# EAGLE design Occupancy PCB Final Rev B (EAGLE 7.5.0)
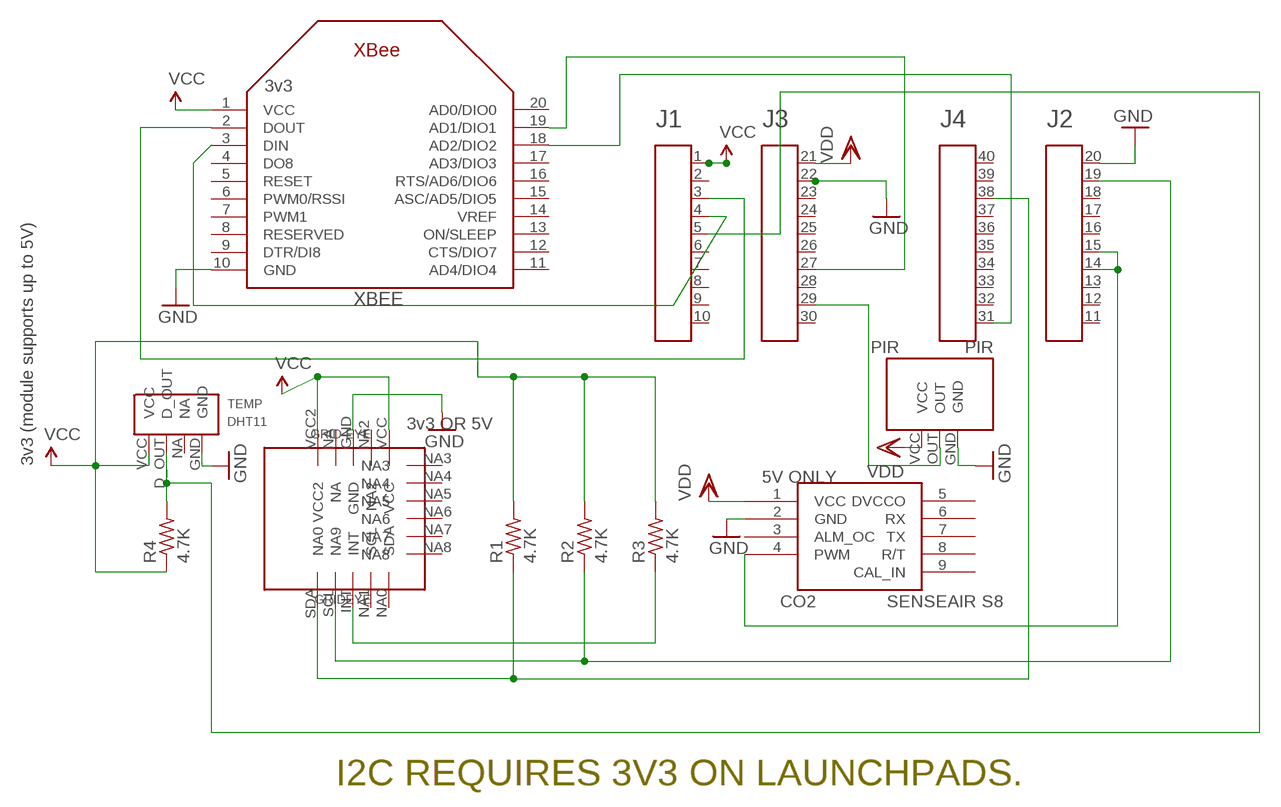
[diagram p0: schematic, sheet 1]

## Parts
CO2  SENSEAIR-S8-DIP  [SENSEAIR-S8-DIP]
GRIDEYE  GRID-EYE-DIP  [GRID-EYE-DIP]
LAUNCHPAD  HEADER4X10-BOOSTERPACK  [4X10-BOOSTERPACK]
PIR  PIR-DIP  [PIR-DIP]
R1  4.7K  R-US_R0805  [R0805]
R2  4.7K  R-US_R0805  [R0805]
R3  4.7K  R-US_R0805  [R0805]
R4  4.7K  R-US_R0805  [R0805]
TEMP  DHT11-DIP  [DHT11-DIP]
XBEE  XBEE  [XBEE]

## Nets
GND: CO2.2(GND) GRIDEYE.GND LAUNCHPAD.20 LAUNCHPAD.22 PIR.GND TEMP.GND XBEE.10(GND)
N$1: LAUNCHPAD.31 XBEE.18(AD2/DIO2)
N$2: GRIDEYE.SDA(NA0) LAUNCHPAD.38 R1.1
N$3: CO2.4(PWM) LAUNCHPAD.14 LAUNCHPAD.15
N$4: LAUNCHPAD.3 XBEE.2(DOUT)
N$5: LAUNCHPAD.4 XBEE.3(DIN)
N$6: GRIDEYE.SCL(NA9) LAUNCHPAD.19 R2.1
N$7: GRIDEYE.INT R3.1
N$8: LAUNCHPAD.5 R4.2 TEMP.D_OUT
N$10: LAUNCHPAD.27 XBEE.19(AD1/DIO1)
N$12: LAUNCHPAD.29 PIR.OUT
VCC [VCC]: GRIDEYE.VCC GRIDEYE.VCC2 LAUNCHPAD.1 R1.2 R2.2 R3.2 R4.1 TEMP.VCC XBEE.1(VCC)
VDD [VCC]: CO2.1(VCC) LAUNCHPAD.21 PIR.VCC
Unconnected: CO2.3(ALM_OC) CO2.5(DVCCO) CO2.6(RX) CO2.7(TX) CO2.8(R/T) CO2.9(CAL_IN) GRIDEYE.NA GRIDEYE.NA0(SDA) GRIDEYE.NA1(SCL) GRIDEYE.NA2 GRIDEYE.NA3 GRIDEYE.NA4 GRIDEYE.NA5 GRIDEYE.NA6 GRIDEYE.NA7 GRIDEYE.NA8 LAUNCHPAD.2 LAUNCHPAD.6 LAUNCHPAD.7 LAUNCHPAD.8 LAUNCHPAD.9 LAUNCHPAD.10 LAUNCHPAD.11 LAUNCHPAD.12 LAUNCHPAD.13 LAUNCHPAD.16 LAUNCHPAD.17 LAUNCHPAD.18 LAUNCHPAD.23 LAUNCHPAD.24 LAUNCHPAD.25 LAUNCHPAD.26 LAUNCHPAD.28 LAUNCHPAD.30 LAUNCHPAD.32 LAUNCHPAD.33 LAUNCHPAD.34 LAUNCHPAD.35 LAUNCHPAD.36 LAUNCHPAD.37 LAUNCHPAD.39 LAUNCHPAD.40 TEMP.NA XBEE.4(DO8) XBEE.5(RESET) XBEE.6(PWM0/RSSI) XBEE.7(PWM1) XBEE.8(RESERVED) XBEE.9(DTR/DI8) XBEE.11(AD4/DIO4) XBEE.12(CTS/DIO7) XBEE.13(ON/SLEEP) XBEE.14(VREF) XBEE.15(ASC/AD5/DIO5) XBEE.16(RTS/AD6/DIO6) XBEE.17(AD3/DIO3) XBEE.20(AD0/DIO0)

## Notes on the sheet
- 3v3
- 3v3 OR 5V
- 3v3 (module supports up to 5V)
- 5V ONLY
- I2C REQUIRES 3V3 ON LAUNCHPADS.

## Library data of the parts
CO2 = LUJAN:SENSEAIR-S8-DIP
GRIDEYE = LUJAN:GRID-EYE-DIP
LAUNCHPAD = EAGLE_BoosterPack_Library:HEADER4X10-BOOSTERPACK
PIR = LUJAN:PIR-DIP
R1-R4 = adafruit:R-US_: RESISTOR, American symbol
TEMP = LUJAN:DHT11-DIP
XBEE = adafruit:XBEE

## Net classes
0 default: width 0.406 mm, drill 0.508 mm, clearance 0.559 mm
1 VCC: width 0.559 mm, drill 0.508 mm, clearance 0.457 mm
2 GND: width 0.508 mm, drill 0.508 mm, clearance 0.457 mm

## Board
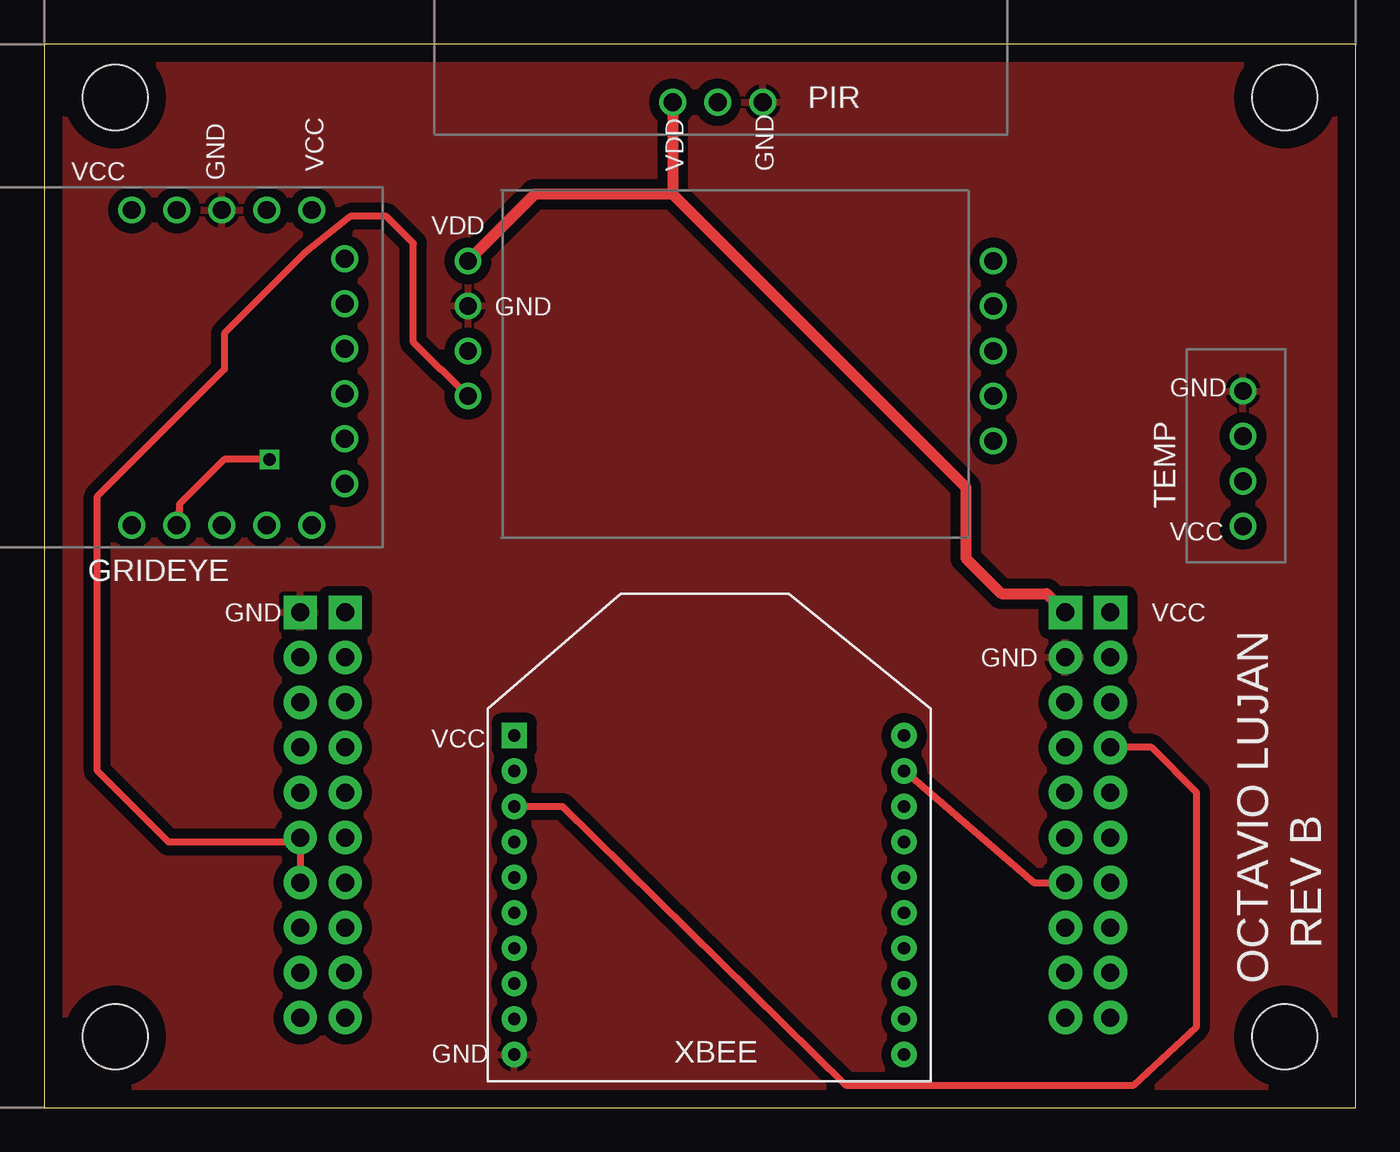
[diagram p1: board, top side]
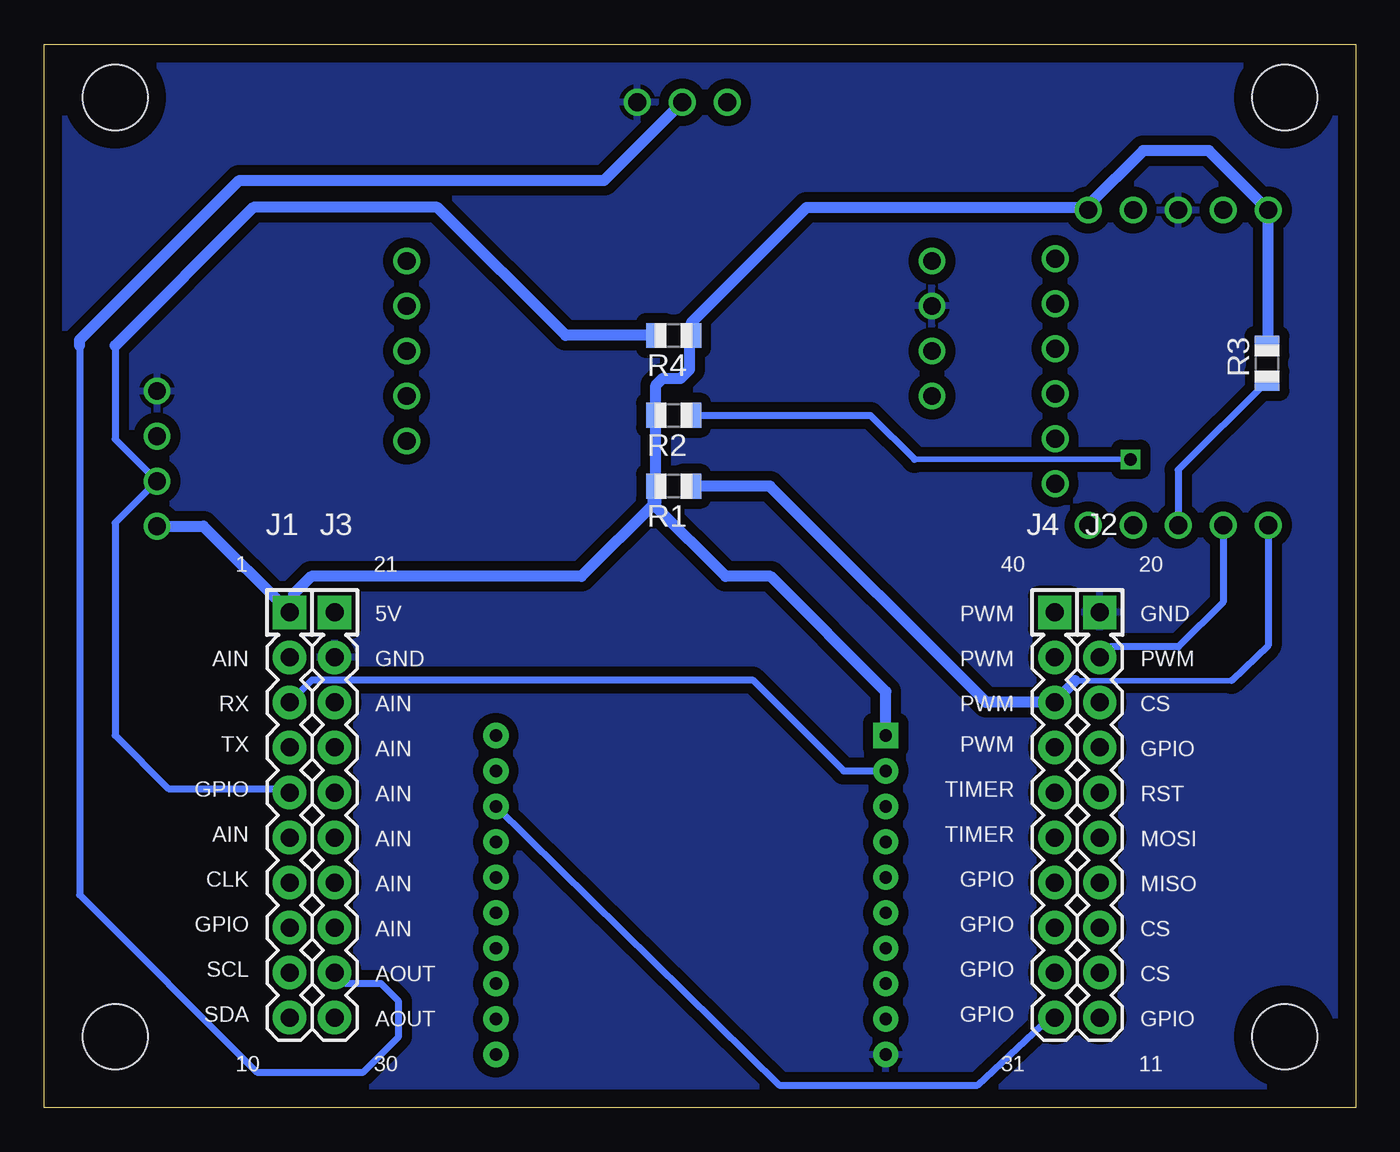
[diagram p2: board, bottom side, seen from below]

Size 74 x 60 mm. Coordinates in mm from the lower left corner, seen from the top.
Outline: 0,0 74,0 74,60 0,60 0,0
Copper layers (1*16): Top 0.035mm / dielectric 1.5mm / Bottom 0.035mm
Design rules "default": minimum track width 10mil, minimum drill 24mil, track to track 8mil, track to pad 8mil, pad to pad 8mil, via to via 8mil, smd to smd 8mil, copper to edge 40mil, drill to drill 8mil, minimum pad ring 10mil, minimum via ring 8mil, stop-mask expansion 4mil, vias tented up to drill 0mil, thermal gap 10mil
Holes 3.7 mm at 4,57 70,57 4,4 70,4

### Footprints (pad centres in the part's own frame; a part is rotated, then mirrored left to right if it is on the bottom)
SENSEAIR-S8-DIP = drill 1: 1 -18.055,5.185; 2 -18.055,2.645; 3 -18.055,0.105; 4 -18.055,-2.435; 5 11.585,5.185; 6 11.585,2.645; 7 11.585,0.105; 8 11.585,-2.435; 9 11.585,-4.975
GRID-EYE-DIP = drill 1: GND 0.985,-8.645; INT 0.985,9.135; NA 3.525,-8.645; NA0 -4.095,9.135; NA1 -1.555,9.135; NA2 -1.555,-8.645; NA3 -5.955,-5.905; NA4 -5.955,-3.365; NA5 -5.955,-0.825; NA6 -5.955,1.715; NA7 -5.955,4.255; NA8 -5.955,6.795; SCL 3.525,9.135; SDA 6.065,9.135; VCC -4.095,-8.645; VCC2 6.065,-8.645
4X10-BOOSTERPACK = drill 1.016 pad 1.88 square: 1 0,10.16; 20 45.72,10.16; 21 2.54,10.16; 40 43.18,10.16 | drill 1.016 pad 1.88: 2 0,7.62; 3 0,5.08; 4 0,2.54; 5 0,0; 6 0,-2.54; 7 0,-5.08; 8 0,-7.62; 9 0,-10.16; 10 0,-12.7; 11 45.72,-12.7; 12 45.72,-10.16; 13 45.72,-7.62; 14 45.72,-5.08; 15 45.72,-2.54; 16 45.72,0; 17 45.72,2.54; 18 45.72,5.08; 19 45.72,7.62; 22 2.54,7.62; 23 2.54,5.08; 24 2.54,2.54; 25 2.54,0; 26 2.54,-2.54; 27 2.54,-5.08; 28 2.54,-7.62; 29 2.54,-10.16; 30 2.54,-12.7; 31 43.18,-12.7; 32 43.18,-10.16; 33 43.18,-7.62; 34 43.18,-5.08; 35 43.18,-2.54; 36 43.18,0; 37 43.18,2.54; 38 43.18,5.08; 39 43.18,7.62
PIR-DIP = drill 1: GND 2.54,-10.35; OUT 0,-10.35; VCC -2.54,-10.35
R0805 = smd 1.1 x 1.4: 1 -1,0; 2 1,0
DHT11-DIP = drill 1: D_OUT -1.651,-0.635; GND 3.429,-0.635; NA 0.889,-0.635; VCC -4.191,-0.635
XBEE = drill 0.7 pad 1.422 square: 1 -11,5.5 | drill 0.7 pad 1.422: 2 -11,3.5; 3 -11,1.5; 4 -11,-0.5; 5 -11,-2.5; 6 -11,-4.5; 7 -11,-6.5; 8 -11,-8.5; 9 -11,-10.5; 10 -11,-12.5; 11 11,-12.5; 12 11,-10.5; 13 11,-8.5; 14 11,-6.5; 15 11,-4.5; 16 11,-2.5; 17 11,-0.5; 18 11,1.5; 19 11,3.5; 20 11,5.5

### Placement (x,y rotation side)
CO2  41.97,42.59 0 top
GRIDEYE  11,42 180 top
LAUNCHPAD  60.16,17.78 0 bottom
PIR  38,67.08 0 top
R1  38.49,35.06 180 bottom
R2  38.49,39.06 180 bottom
R3  5,42 90 bottom
R4  38.49,43.57 180 bottom
TEMP  67,37 90 top
XBEE  37.52,15.49 0 top

### Tracks (layer width: path | path; a pad name or v marks a point on that pad's centre or on a via)
GND
  pour Bottom: 0,60 0,0 75,0 75,60
  pour Top: 0,60 0,0 75,0 75,60
N$1
  Bottom 0.406: XBEE.18 32.54,1.27 21.34,1.27 17.27,5.08 LAUNCHPAD.31
N$2
  Bottom 0.305: 7,24.1 15.84,24.1
  Bottom 0.406: GRIDEYE.SDA 4.93,26.07 7,24.1
  Bottom 0.61: 15.84,24.1 LAUNCHPAD.38 20.86,22.86 33.06,35.06 R1.1
N$3
  Top 0.406: LAUNCHPAD.14 LAUNCHPAD.15 14.2,15 7,15 3,19 3,34.5 10.16,41.66 10.16,43.69 14.73,48.26 17.27,50.29 19.3,50.29 20.83,48.77 20.83,43.18 22.35,41.66 22.41,41.66 CO2.4
N$4
  Bottom 0.406: LAUNCHPAD.3 58.89,24.13 34.04,24.13 28.9,18.99 XBEE.2 26.87,18.99
N$5
  Top 0.406: XBEE.3 29.23,16.99 45.21,1.27 61.47,1.27 65.02,4.57 65.02,17.78 62.48,20.32 LAUNCHPAD.4
N$6  (via drill 0.7)
  Top 0.406: v12.7,36.58 10.16,36.58 7.62,34.04 7.62,33.01 GRIDEYE.SCL
  Bottom 0.305: 24.89,36.58 v12.7,36.58
  Bottom 0.406: GRIDEYE.SCL 7.47,28.52 10,26 13.84,26 LAUNCHPAD.19 | R2.1 27.38,39.06 24.89,36.58
N$7
  Bottom 0.406: R3.1 10.02,35.98 GRIDEYE.INT
N$8
  Bottom 0.406: 70,43 70,37.71 TEMP.D_OUT 70,33 70,21 67,18 60.38,18 LAUNCHPAD.5
  Bottom 0.61: R4.2 44.59,43.57 51.82,50.8 62.2,50.8 70,43
N$10
  Top 0.406: XBEE.19 55.83,12.7 LAUNCHPAD.27
N$12
  Bottom 0.406: 72,43 72,12 62,2 56,2 54,4 54,6 55,7 57,7 LAUNCHPAD.29
  Bottom 0.61: 72,43 72,43.32 62.99,52.32 42.41,52.32 PIR.OUT
VCC
  Bottom 0.61: R3.2 4.93,43.06 GRIDEYE.VCC2 8.29,54 12,54 15.1,50.91 GRIDEYE.VCC 15.25,50.8 30.99,50.8 37.49,44.3 R4.1 37.59,43.47 37.59,41.66 38.1,41.15 39.12,41.15 39.49,40.77 R2.2 R1.2 | TEMP.VCC 65.03,32.81 LAUNCHPAD.1 59.94,28.16 59.94,28.96 58.93,29.97 43.69,29.97 39.49,34.17 R1.2 | XBEE.1 26.52,23.47 33.02,29.97 35.56,29.97 39.62,34.04 39.62,34.93 R1.2
VDD
  Top 0.61: PIR.VCC 35.46,51.54 | 35.46,51.54 52,35 52,31 54,29 56.56,29 LAUNCHPAD.21 | 35.46,51.54 27.68,51.54 CO2.1

### Text on the board
tPlace: GND
_tsilk: VCC | VCC | VDD | GND | GND | VDD | GND | GND | VCC | VCC | GND | VCC | REV B | OCTAVIO LUJAN | GND